# EAGLE design MotionerController (EAGLE 6.3)
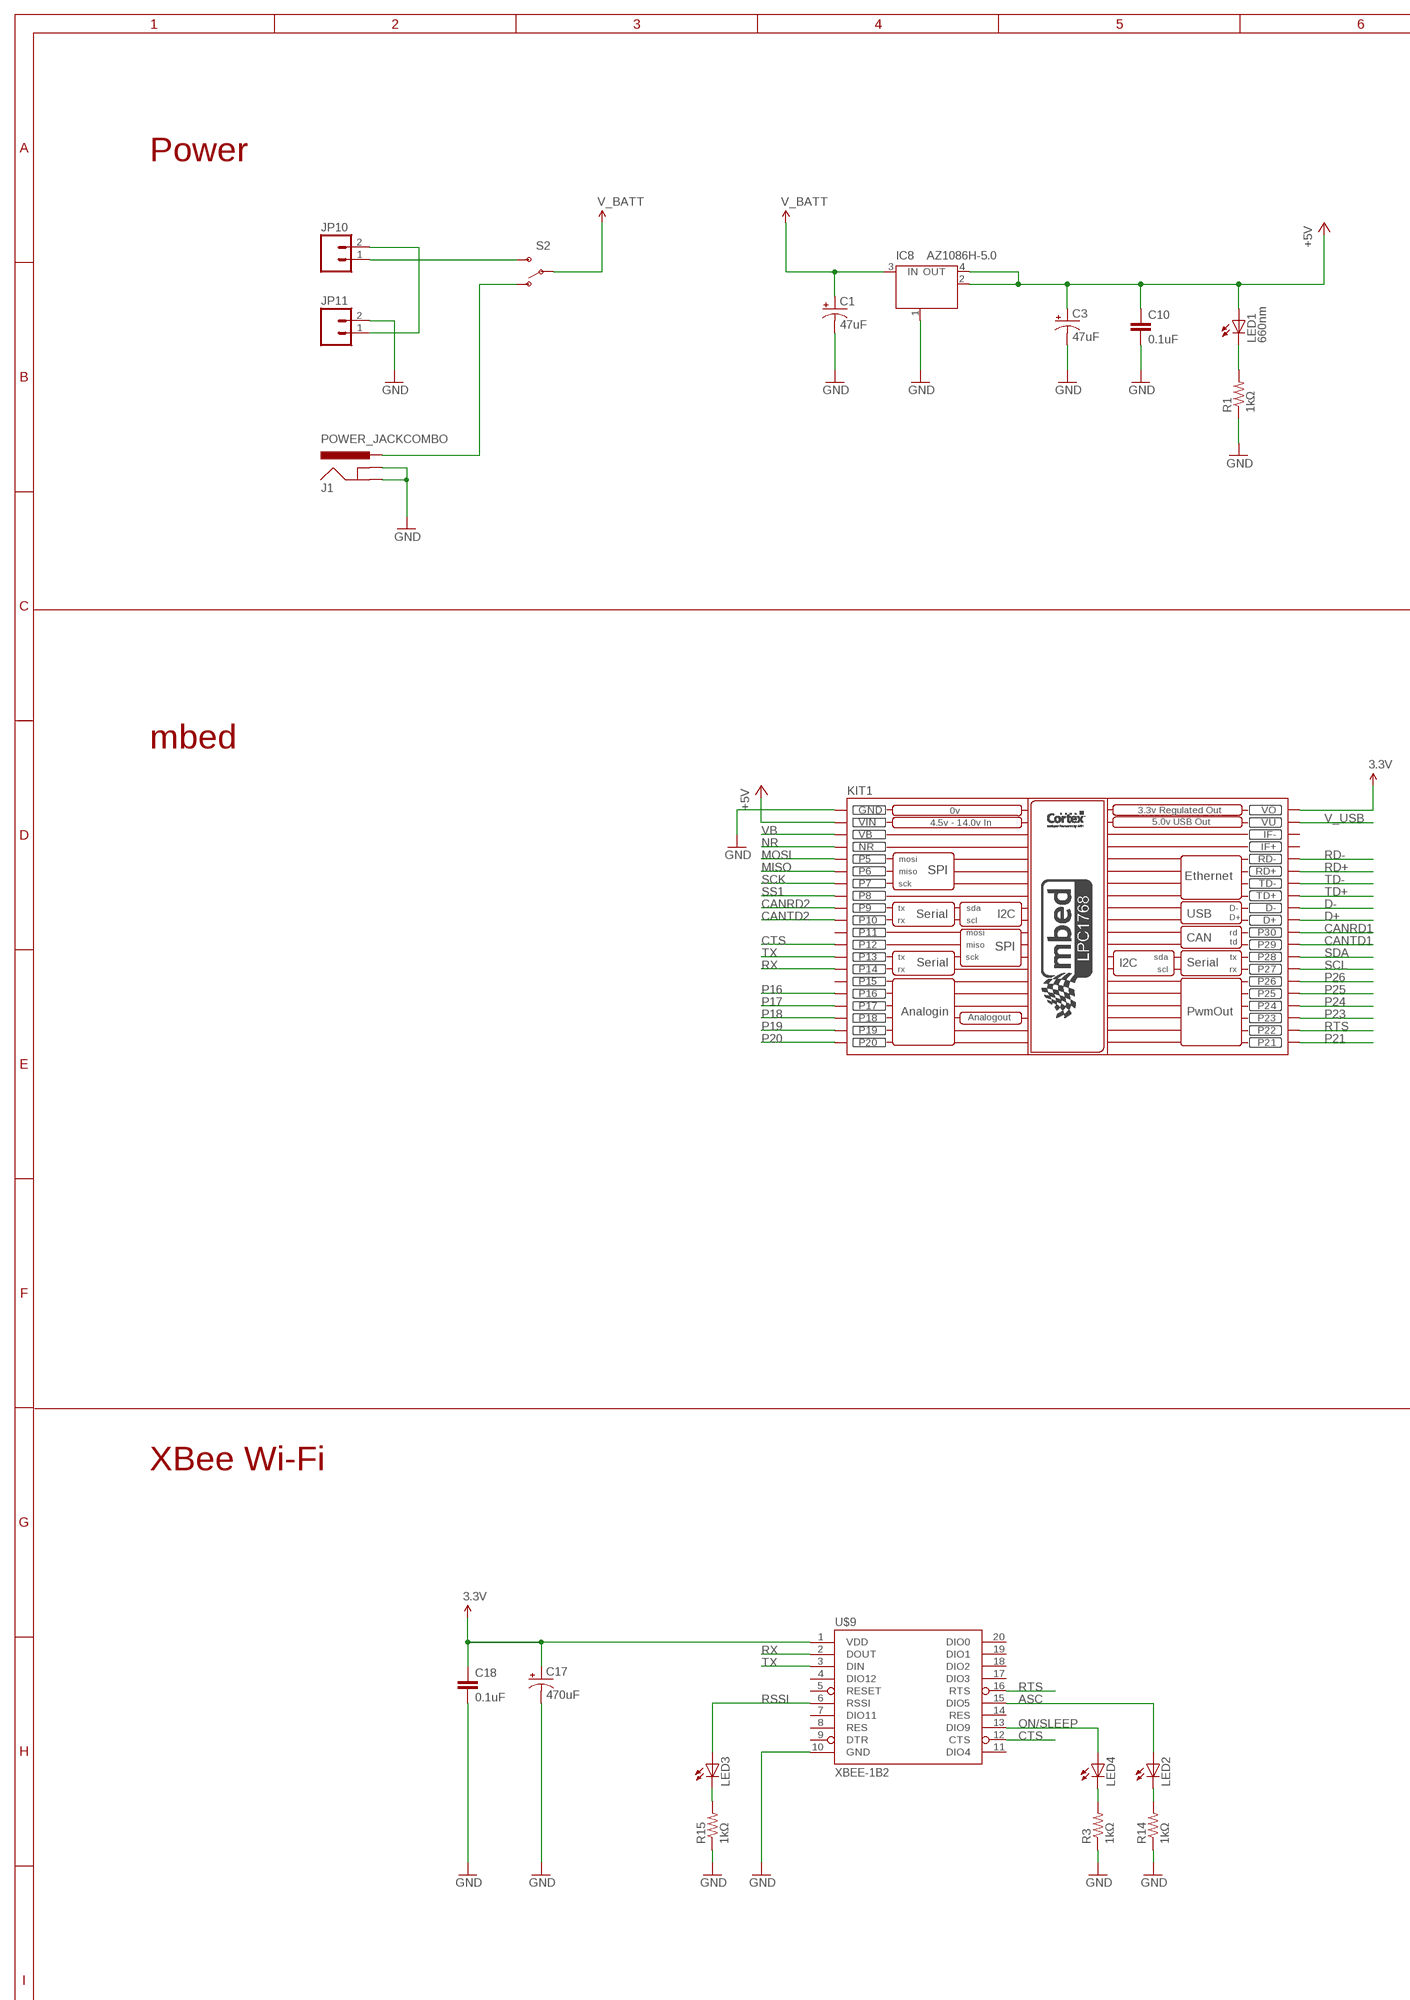
[diagram p0: schematic, sheet 1, part 1 of 2]
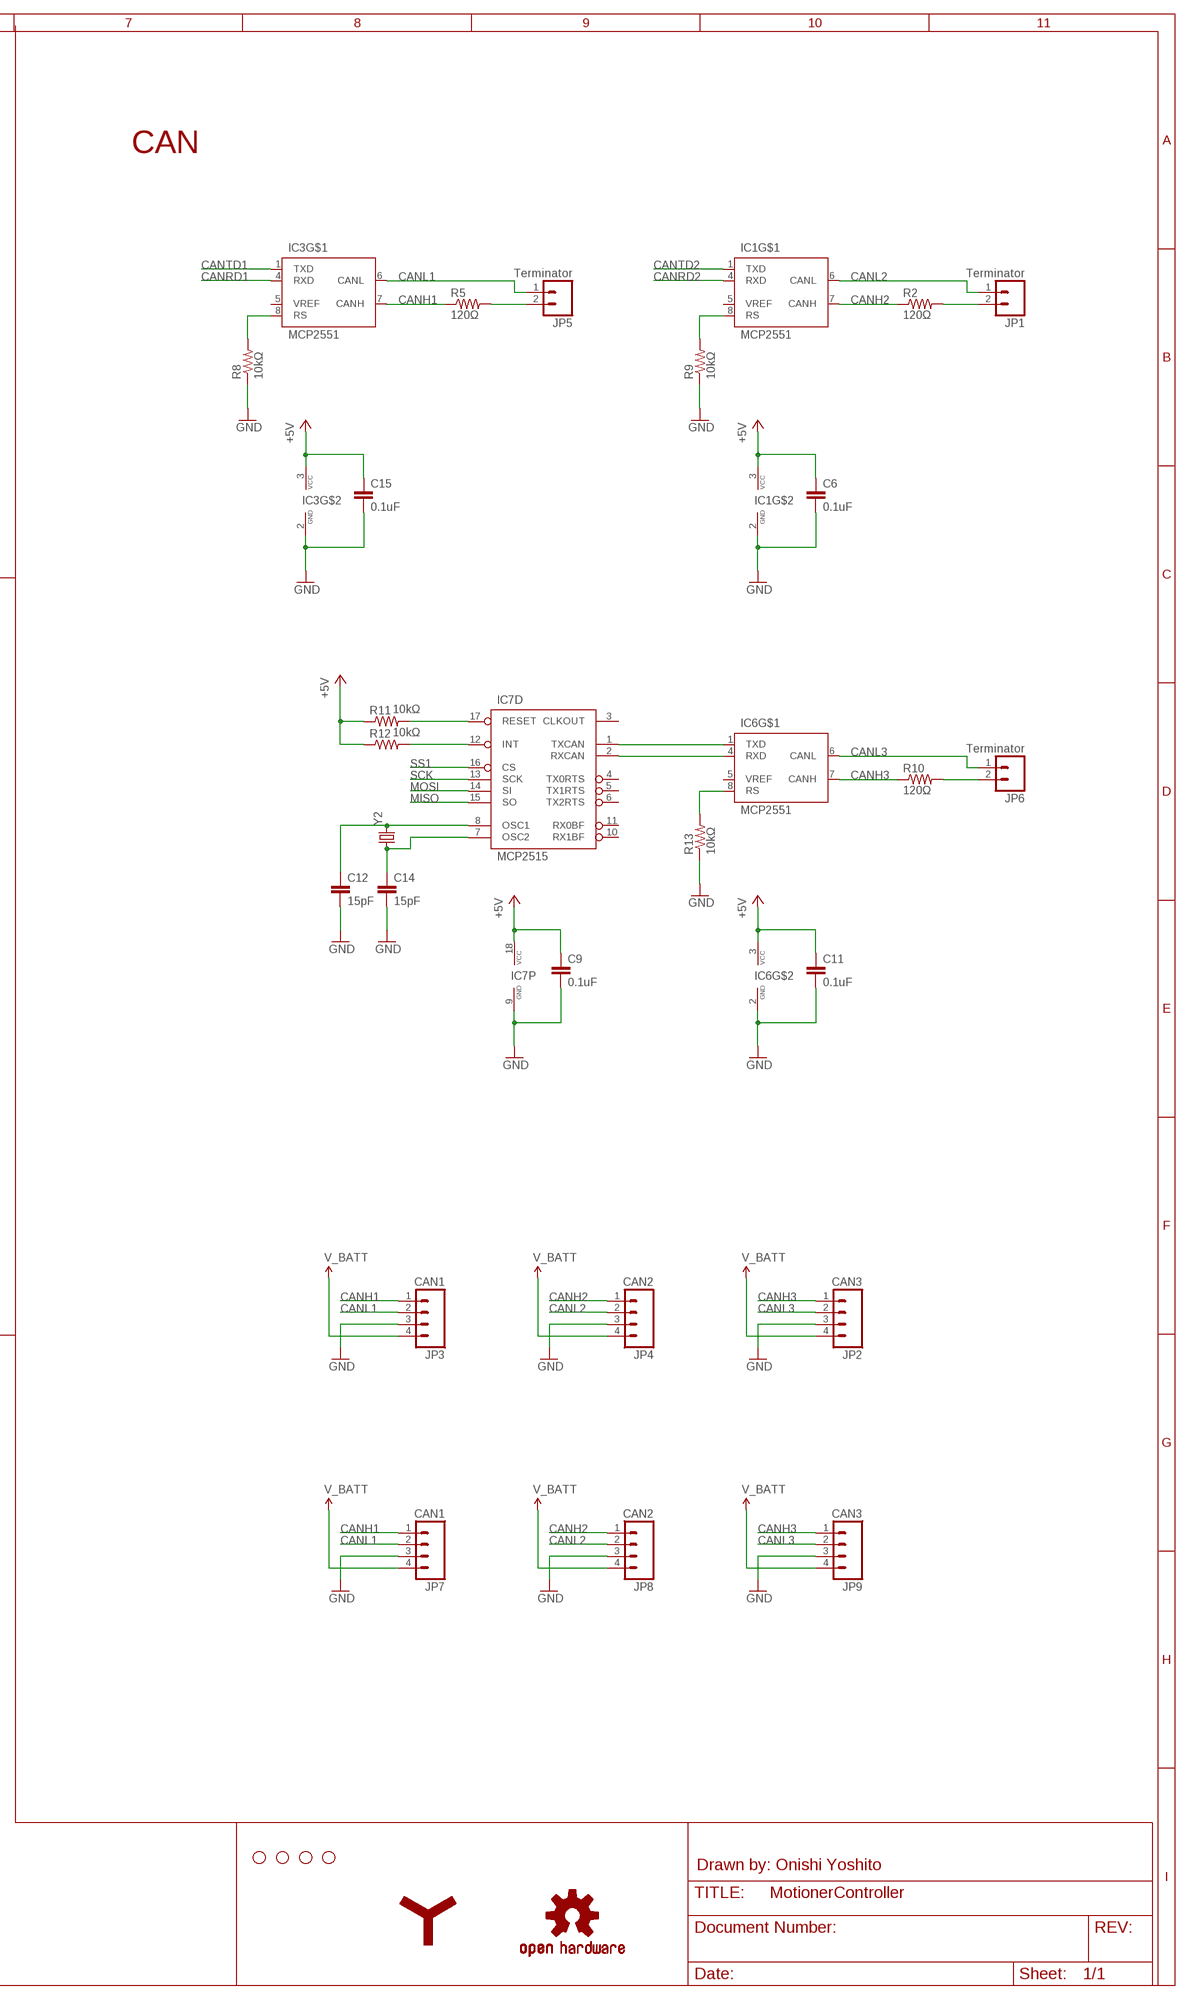
[diagram p1: schematic, sheet 1, part 2 of 2]

## Parts
C1  47uF  CAP_POLD  [PANASONIC_D]
C3  47uF  CAP_POLD  [PANASONIC_D]
C6  0.1uF  CAP0603-CAP  [0603-CAP]
C9  0.1uF  CAP0603-CAP  [0603-CAP]
C10  0.1uF  CAP0603-CAP  [0603-CAP]
C11  0.1uF  CAP0603-CAP  [0603-CAP]
C12  15pF  CAP0603-CAP  [0603-CAP]
C14  15pF  CAP0603-CAP  [0603-CAP]
C15  0.1uF  CAP0603-CAP  [0603-CAP]
C17  470uF  CAP_POLG  [PANASONIC_G]
C18  0.1uF  CAP0603-CAP  [0603-CAP]
IC1  MCP2551  MCP2551SO8  [SO08]
IC3  MCP2551  MCP2551SO8  [SO08]
IC6  MCP2551  MCP2551SO8  [SO08]
IC7  MCP2515  MCP2515SO  [SO-18W]
IC8  AZ1086H-5.0  MC33269ST-3.3T3  [SOT223]
J1  POWER_JACKCOMBO  [POWER_JACK_COMBO]
JP1  Terminator  M02PTH  [1X02]
JP2  CAN3  M04JST-PTH  [JST-4-PTH]
JP3  CAN1  M04JST-PTH  [JST-4-PTH]
JP4  CAN2  M04JST-PTH  [JST-4-PTH]
JP5  Terminator  M02PTH  [1X02]
JP6  Terminator  M02PTH  [1X02]
JP7  CAN1  M04JST-PTH  [JST-4-PTH]
JP8  CAN2  M04JST-PTH  [JST-4-PTH]
JP9  CAN3  M04JST-PTH  [JST-4-PTH]
JP10  M02JST-PTH-2  [JST-2-PTH]
JP11  M02JST-PTH-2  [JST-2-PTH]
JP12  STAND-OFF  [STAND-OFF]
JP13  STAND-OFF  [STAND-OFF]
JP15  STAND-OFF  [STAND-OFF]
JP16  STAND-OFF  [STAND-OFF]
KIT1  MBED_NXP_LPC1768  [MBED-KIT]
LED1  660nm  LED0603  [LED-0603]
LED2  LED0603  [LED-0603]
LED3  LED0603  [LED-0603]
LED4  LED0603  [LED-0603]
R1  1kΩ  RESISTOR0603-RES  [0603-RES]
R2  120Ω  RESISTOR0603-RES  [0603-RES]
R3  1kΩ  RESISTOR0603-RES  [0603-RES]
R5  120Ω  RESISTOR0603-RES  [0603-RES]
R8  10kΩ  RESISTOR0603-RES  [0603-RES]
R9  10kΩ  RESISTOR0603-RES  [0603-RES]
R10  120Ω  RESISTOR0603-RES  [0603-RES]
R11  10kΩ  RESISTOR0603-RES  [0603-RES]
R12  10kΩ  RESISTOR0603-RES  [0603-RES]
R13  10kΩ  RESISTOR0603-RES  [0603-RES]
R14  1kΩ  RESISTOR0603-RES  [0603-RES]
R15  1kΩ  RESISTOR0603-RES  [0603-RES]
S2  SWITCH-SPDTPTH  [SWITCH-SPDT]
U$9  XBEE-1B2  [XBEE-SILK]
U$10  YCAM_LOGO_L  [YCAM_LOGO_L]
U$12  OSHW-LOGOL  [OSHW-LOGO-L]
Y2  CRYSTAL5X3  [CRYSTAL-SMD-5X3]

## Nets
3.3V: C17.+ C18.1 KIT1.VOUT(VO) U$9.1(VDD)
7.4V [VBATT]: C1.+ IC8.3(IN) JP2.4 JP3.4 JP4.4 JP7.4 JP8.4 JP9.4 S2.2(P) ; supply symbol labelled V_BATT
+5V [+5V]: C3.+ C6.1 C9.1 C10.1 C11.1 C15.1 IC1.3(VCC) IC3.3(VCC) IC6.3(VCC) IC7.18(P:VCC) IC8.2(OUT) IC8.4(OUT) KIT1.VIN LED1.A R11.1 R12.1
ASC: LED2.A U$9.15(DIO5)
CANH1: IC3.7(CANH) JP3.1 JP7.1 R5.1
CANH2: IC1.7(CANH) JP4.1 JP8.1 R2.1
CANH3: IC6.7(CANH) JP2.1 JP9.1 R10.1
CANL1: IC3.6(CANL) JP3.2 JP5.1 JP7.2
CANL2: IC1.6(CANL) JP1.1 JP4.2 JP8.2
CANL3: IC6.6(CANL) JP2.2 JP6.1 JP9.2
CANRD1: IC3.4(RXD) KIT1.P$30(P30)
CANRD2: IC1.4(RXD) KIT1.P$9(P9)
CANTD1: IC3.1(TXD) KIT1.P$29(P29)
CANTD2: IC1.1(TXD) KIT1.P$10(P10)
CTS: KIT1.P$12(P12) U$9.12(CTS)
D+: KIT1.D+
D-: KIT1.D-
GND [GND]: C1.- C3.- C6.2 C9.2 C10.2 C11.2 C12.2 C14.2 C15.2 C17.- C18.2 IC1.2(GND) IC3.2(GND) IC6.2(GND) IC7.9(P:GND) IC8.1(GND/ADJ) J1.GND(GNDBREAK) J1.GND@1(GND) JP2.3 JP3.3 JP4.3 JP7.3 JP8.3 JP9.3 JP11.2 KIT1.GND R1.1 R3.1 R8.1 R9.1 R13.1 R14.1 R15.1 U$9.10(GND)
MISO: IC7.15(D:SO) KIT1.P$6(P6)
MOSI: IC7.14(D:SI) KIT1.P$5(P5)
N$1: LED1.C R1.2
N$2: J1.POWER(PWR) S2.1(O)
N$3: LED4.C R3.2
N$4: JP10.1 S2.3(S)
N$8: IC3.8(RS) R8.2
N$13: IC1.8(RS) R9.2
N$14: JP1.2 R2.2
N$17: IC6.1(TXD) IC7.1(D:TXCAN)
N$18: IC6.4(RXD) IC7.2(D:RXCAN)
N$19: IC7.12(D:INT) R12.2
N$20: JP5.2 R5.2
N$21: IC7.17(D:RESET) R11.2
N$22: IC6.8(RS) R13.2
N$23: JP6.2 R10.2
N$24: C12.1 IC7.8(D:OSC1) Y2.3
N$25: C14.1 IC7.7(D:OSC2) Y2.1
N$27: JP10.2 JP11.1
N$30: LED3.C R15.2
N$33: LED2.C R14.2
NR: KIT1.NR
ON/SLEEP: LED4.A U$9.13(DIO9)
P16: KIT1.P$16(P16)
P17: KIT1.P$17(P17)
P18: KIT1.P$18(P18)
P19: KIT1.P$19(P19)
P20: KIT1.P$20(P20)
P21: KIT1.P$21(P21)
P23: KIT1.P$23(P23)
P24: KIT1.P$24(P24)
P25: KIT1.P$25(P25)
P26: KIT1.P$26(P26)
RD+: KIT1.RD+
RD-: KIT1.RD-
RSSI: LED3.A U$9.6(RSSI)
RTS: KIT1.P$22(P22) U$9.16(RTS)
RX: KIT1.P$14(P14) U$9.2(DOUT)
SCK: IC7.13(D:SCK) KIT1.P$7(P7)
SCL: KIT1.P$27(P27)
SDA: KIT1.P$28(P28)
SS1: IC7.16(D:CS) KIT1.P$8(P8)
TD+: KIT1.TD+
TD-: KIT1.TD-
TX: KIT1.P$13(P13) U$9.3(DIN)
V_USB: KIT1.VU
VB: KIT1.VB
Unconnected: IC1.5(VREF) IC3.5(VREF) IC6.5(VREF) IC7.3(D:CLKOUT) IC7.4(D:TX0RTS) IC7.5(D:TX1RTS) IC7.6(D:TX2RTS) IC7.10(D:RX1BF) IC7.11(D:RX0BF) KIT1.IF+ KIT1.IF- KIT1.P$11(P11) KIT1.P$15(P15) U$9.4(DIO12) U$9.5(RESET) U$9.7(DIO11) U$9.8(RES) U$9.9(DTR) U$9.11(DIO4) U$9.14(RES) U$9.17(DIO3) U$9.18(DIO2) U$9.19(DIO1) U$9.20(DIO0)

## Notes on the sheet
- Power | CAN
- mbed
- XBee Wi-Fi
- Drawn by: Onishi Yoshito

## Library data of the parts
C1 C3 C17 = SparkFun-Passives:CAP_POL: Capacitor Polarized These are standard SMD and PTH capacitors. Normally 10uF, 47uF, and 100uF in electrolytic and tantalum varieties. Always verify the external diameter of the through hole cap, it varies with capacity, voltage, and manufacturer. The EIA devices should be standard.
C6 C9-C12 C14 C15 C18 = SparkFun-Passives:CAP: Capacitor Standard 0603 ceramic capacitor, and 0.1" leaded capacitor.
IC1 IC3 IC6 = can:MCP2551: CAN Tranceiver Microchip
IC7 = can:MCP2515: MC2515 Stand-Alone CAN Controller With SPI Interface, Microchip
IC8 = linear:MC33269ST*: Adjustable Output Low Dropout Voltage Regulator 800 mA Source: http://www.onsemi.com/pub/Collateral/MC33269-D.PDF
J1 = SparkFun-Connectors:POWER_JACK: Power Jack This is the standard 5.5mm barrel jack for power. The PTH is the most common, proven, reliable, footprint. All others are experimental. The Slot footprint only works if the mill layer is transmitted to the PCB fab house so be warned. Spark Fun Electronics SKU : PRT-00119. Mating wall wart : TOL-00298 (and others)
JP1 JP5 JP6 JP10 JP11 = SparkFun-Connectors:M02: Header 2 Standard 2-pin 0.1" header. Use with straight break away headers (SKU : PRT-00116), right angle break away headers (PRT-00553), swiss pins (PRT-00743), machine pins (PRT-00117), and female headers (PRT-00115). Molex polarized connector foot print use with SKU : PRT-08233 with associated crimp pins and housings.
JP2-JP4 JP7-JP9 = SparkFun-Connectors:M04: Header 4 Standard 4-pin 0.1" header. Use with straight break away headers (SKU : PRT-00116), right angle break away headers (PRT-00553), swiss pins (PRT-00743), machine pins (PRT-00117), and female headers (PRT-00115). Molex polarized connector foot print use with SKU : PRT-08231 with associated crimp pins and housings. 1MM SMD Version SKU: PRT-10208
JP12 JP13 JP15 JP16 = SparkFun-Electromechanical:STAND-OFF: #4 Stand Off This is the mechanical footprint for a #4 phillips button head screw. Use the keepout ring to avoid running the screw head into surrounding components. SKU : PRT-00447
KIT1 = MBED_v2.1:MBED_NXP_LPC1768: Mbed LPC1768 - ARM CORTEX v2.1 * Schematic symbol is now placed in eagles's default raster. *The pads diameter are suitable for routing between mbed pins * mbed pads are 0.8 mm drill diameter. --------------------------------------------- Created by: Mohamed Yousry *Alexandria, Egypt *Email: mohamed.yousry@ieeegoldegypt.org
LED1-LED4 = SparkFun-LED:LED: LEDs Standard schematic elements and footprints for 5mm, 3mm, 1206, and 0603 sized LEDs. 5mm - Spark Fun Electronics SKU : COM-00529 (and others)
R1-R3 R5 R8-R15 = SparkFun-Passives:RESISTOR: Resistor Basic schematic elements and footprints for 0603, 1206, and PTH resistors.
S2 = SparkFun-Electromechanical:SWITCH-SPDT: SPST Switch Simple slide switch. Spark Fun Electronics SKU : COM-00102
U$9 = SparkFun-RF:XBEE-1: Xbee module footprints
U$10 = ram:YCAM_LOGO_L
U$12 = SparkFun-Aesthetics:OSHW-LOGO: Open Source Hardware Logo This logo indicates the piece of hardware it is found on incorporates a OSHW license and/or adheres to the definition of open source hardware found here: http://freedomdefined.org/OSHW
Y2 = SparkFun-FreqCtrl:CRYSTAL: Various standard crystals. Proven footprints. Spark Fun Electronics SKU : COM-00534

## Net classes
0 Default: width 0.203 mm

## Board
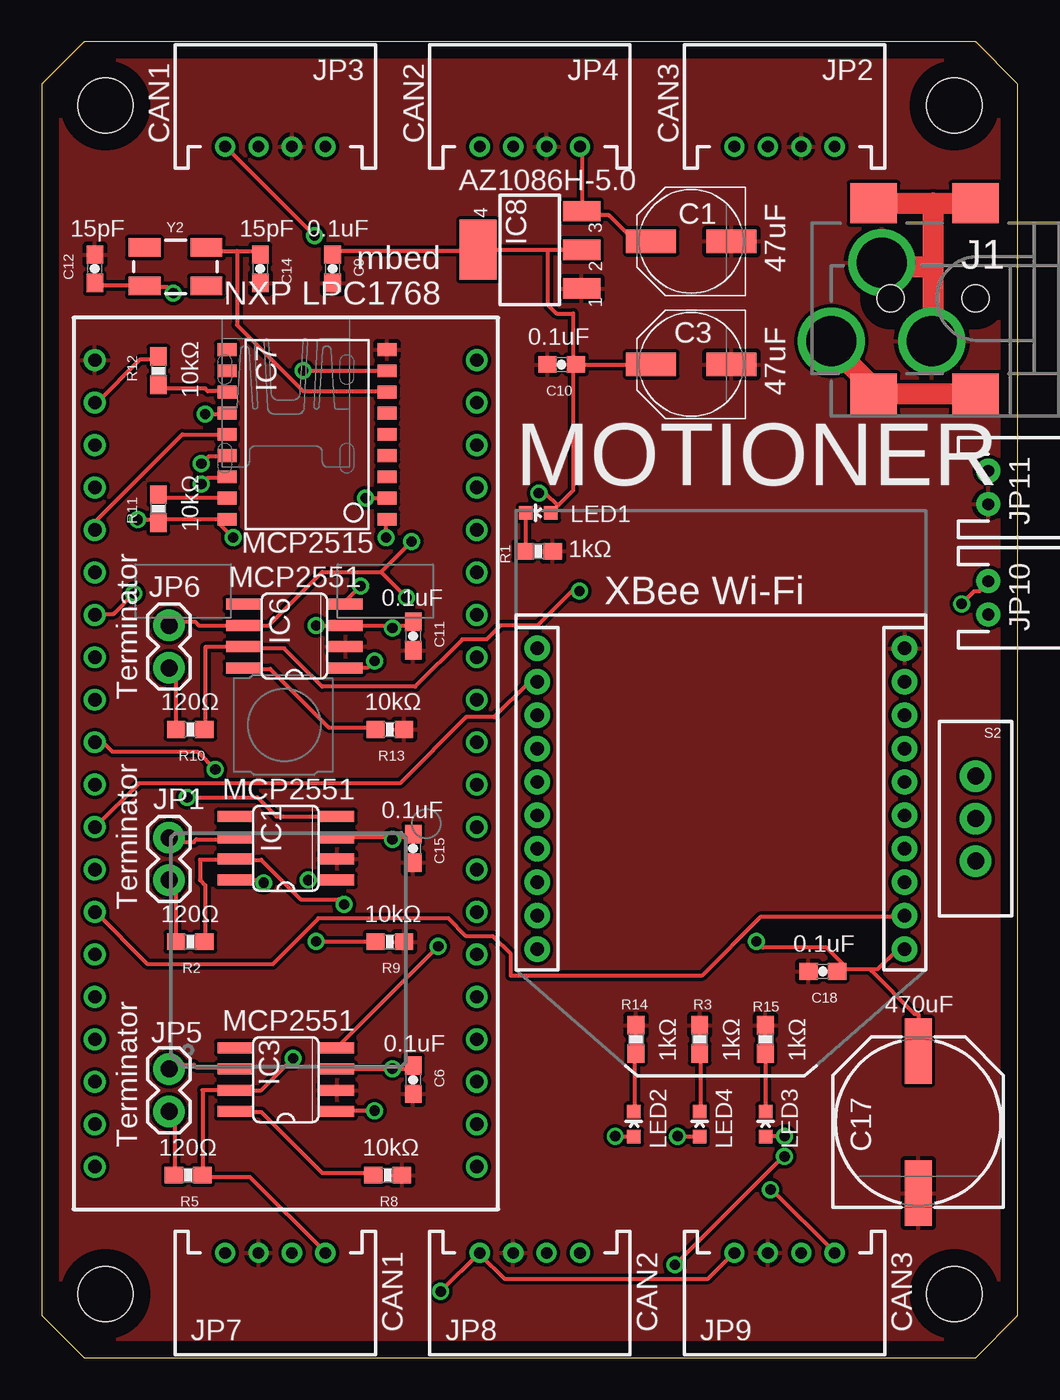
[diagram p2: board, top side]
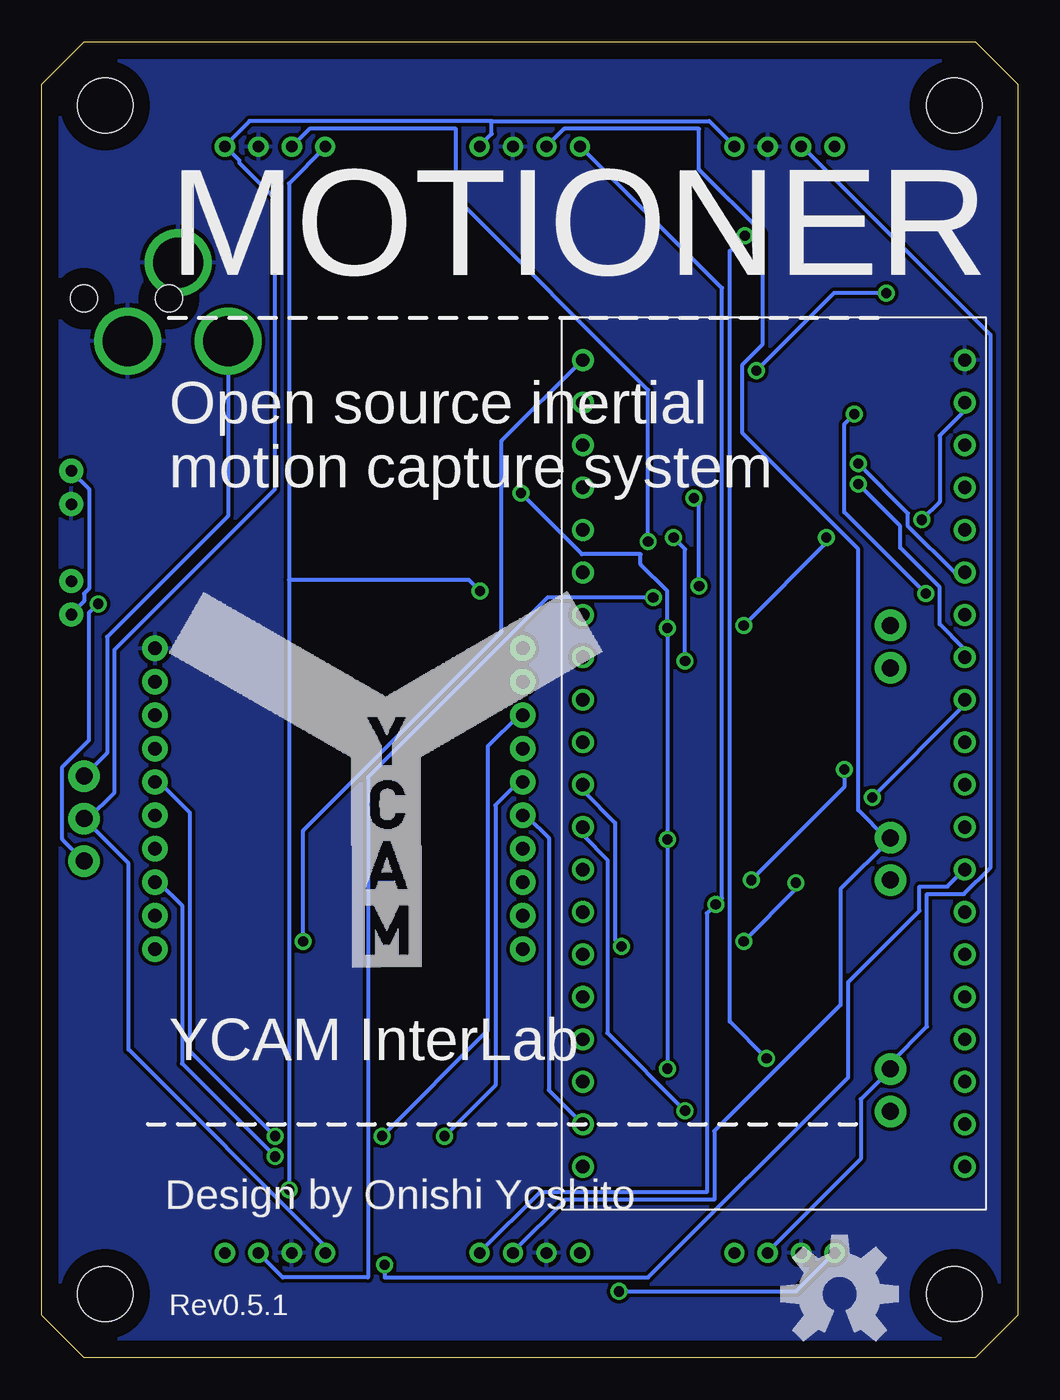
[diagram p3: board, bottom side, seen from below]

Size 58.41 x 78.74 mm. Coordinates in mm from the lower left corner, seen from the top.
Outline: 0,2.54 2.54,0 55.88,0 58.41,2.54 58.41,76.19 55.88,78.74 2.54,78.74 0,76.19 0,2.54
Copper layers (1*16): Top 0.035mm / dielectric 1.5mm / Bottom 0.035mm
Design rules "default": minimum track width 10mil, minimum drill 24mil, track to track 8mil, track to pad 8mil, pad to pad 8mil, via to via 8mil, smd to smd 8mil, copper to edge 40mil, drill to drill 8mil, minimum pad ring 10mil, minimum via ring 8mil, stop-mask expansion 4mil, vias tented up to drill 0mil, thermal gap 10mil

### Footprints (pad centres in the part's own frame; a part is rotated, then mirrored left to right if it is on the bottom)
PANASONIC_D = smd 3 x 1.4: + 2.4,0; - -2.4,0
0603-CAP = smd 1.1 x 1: 1 -0.85,0; 2 0.85,0
PANASONIC_G = smd 3.9 x 1.6: + 4.25,0; - -4.25,0
SO08 = smd 0.66 x 2.032: 1 -1.905,-3.073; 2 -0.635,-3.073; 3 0.635,-3.073; 4 1.905,-3.073; 5 1.905,3.073; 6 0.635,3.073; 7 -0.635,3.073; 8 -1.905,3.073
SO-18W = smd 0.762 x 1.143: 1 -5.08,-4.788; 2 -3.81,-4.788; 3 -2.54,-4.788; 4 -1.27,-4.788; 5 0,-4.788; 6 1.27,-4.788; 7 2.54,-4.788; 8 3.81,-4.788; 9 5.08,-4.788; 10 5.08,4.788; 11 3.81,4.788; 12 2.54,4.788; 13 1.27,4.788; 14 0,4.788; 15 -1.27,4.788; 16 -2.54,4.788; 17 -3.81,4.788; 18 -5.08,4.788
SOT223 = smd 1.219 x 2.235: 1 -2.311,-3.099; 2 0,-3.099; 3 2.311,-3.099 | smd 3.6 x 2.2: 4 0,3.099
POWER_JACK_COMBO = drill 2.997: GND 5.62,-2.16; GND@1 2.62,2.54; POWER 8.62,2.54 | smd 2.8 x 2.4: GND@3 0,-5.7; GND@4 6.1,-5.7; POWER@1 0,5.7; POWER@2 6.1,5.7 | hole 1.6: 0,0; 5.08,0
1X02 = drill 1.016 pad 1.88: 1 0,0; 2 2.54,0
JST-4-PTH = drill 0.7: 1 -3,-5; 2 -1,-5; 3 1,-5; 4 3,-5
JST-2-PTH = drill 0.7 pad 1.448: 1 -1,0; 2 1,0
STAND-OFF = hole 3.302: 0,0
MBED-KIT = drill 0.8: D+ 11.43,1.27; D- 11.43,3.81; GND -11.43,24.13; IF+ 11.43,16.51; IF- 11.43,19.05; NR -11.43,16.51; P$5 -11.43,13.97; P$6 -11.43,11.43; P$7 -11.43,8.89; P$8 -11.43,6.35; P$9 -11.43,3.81; P$10 -11.43,1.27; P$11 -11.43,-1.27; P$12 -11.43,-3.81; P$13 -11.43,-6.35; P$14 -11.43,-8.89; P$15 -11.43,-11.43; P$16 -11.43,-13.97; P$17 -11.43,-16.51; P$18 -11.43,-19.05; P$19 -11.43,-21.59; P$20 -11.43,-24.13; P$21 11.43,-24.13; P$22 11.43,-21.59; P$23 11.43,-19.05; P$24 11.43,-16.51; P$25 11.43,-13.97; P$26 11.43,-11.43; P$27 11.43,-8.89; P$28 11.43,-6.35; P$29 11.43,-3.81; P$30 11.43,-1.27; RD+ 11.43,11.43; RD- 11.43,13.97; TD+ 11.43,6.35; TD- 11.43,8.89; VB -11.43,19.05; VIN -11.43,21.59; VOUT 11.43,24.13; VU 11.43,21.59
LED-0603 = smd 0.8 x 0.8: A 0,-0.75; C 0,0.75
0603-RES = smd 1.1 x 1: 1 -0.85,0; 2 0.85,0
SWITCH-SPDT = drill 1.016 pad 1.88: 1 0,2.54; 2 0,0; 3 0,-2.54
XBEE-SILK = drill 0.8 pad 1.524: 1 -11,20; 2 -11,18; 3 -11,16; 4 -11,14; 5 -11,12; 6 -11,10; 7 -11,8; 8 -11,6; 9 -11,4; 10 -11,2; 11 11,2; 12 11,4; 13 11,6; 14 11,8; 15 11,10; 16 11,12; 17 11,14; 18 11,16; 19 11,18; 20 11,20
CRYSTAL-SMD-5X3 = smd 1.9 x 1.1: 1 -1.85,-1.15; 2 1.85,-1.15; 3 1.85,1.15; 4 -1.85,1.15

### Placement (x,y rotation side)
C1  38.86,66.8 180 top
C3  38.86,59.44 180 top
C6  22.22,16.64 270 top
C9  17.4,65.15 270 top
C10  31.11,59.44 180 top
C11  22.22,43.18 270 top
C12  3.17,65.15 90 top
C14  13.08,65.15 270 top
C15  22.22,30.48 270 top
C17  52.45,14.1 90 top
C18  46.74,23.11 180 top
IC1  14.61,30.48 90 top
IC3  14.61,16.64 90 top
IC6  15.11,43.18 90 top
IC7  15.87,55.24 90 top
IC8  29.21,66.29 90 top
J1  55.88,63.37 180 top
JP1  7.62,31.11 270 top
JP2  44.45,77.47 0 top
JP3  13.97,77.47 0 top
JP4  29.21,77.47 0 top
JP5  7.62,17.27 270 top
JP6  7.62,43.81 270 top
JP7  13.97,1.27 180 top
JP8  29.21,1.27 180 top
JP9  44.45,1.27 180 top
JP10  56.64,45.47 270 top
JP11  56.64,52.07 270 top
JP12  54.61,74.93 0 top
JP13  54.61,3.81 0 top
JP15  3.81,74.93 90 top
JP16  3.81,3.81 90 top
KIT1  14.61,35.56 0 top
LED1  29.72,50.55 90 top
LED2  35.43,13.97 0 top
LED3  43.31,13.97 0 top
LED4  39.37,13.97 0 top
R1  29.72,48.26 180 top
R2  8.89,24.89 180 top
R3  39.37,19.05 270 top
R5  8.76,10.92 180 top
R8  20.7,10.92 180 top
R9  20.83,24.89 180 top
R10  8.89,37.59 180 top
R11  6.98,50.8 90 top
R12  6.98,59.05 270 top
R13  20.83,37.59 180 top
R14  35.56,19.05 270 top
R15  43.31,19.05 270 top
S2  55.88,32.26 0 top
U$9  40.64,44.45 180 top
U$10  50.8,21.59 0 bottom
U$12  10.67,3.81 0 bottom
Y2  8,65.28 180 top

### Tracks (layer width: path | path; a pad name or v marks a point on that pad's centre or on a via)
3.3V  (via drill 0.61)
  Top 0.254: 49.63,23.24 50.01,23.24 51.16,24.38 51.61,24.38 U$9.1 | 49.63,23.24 47.73,23.24 47.65,23.16 C18.1 47.95,23.32 47.95,23.55 46.97,24.54 43.16,24.54 v42.77,24.92 | C17.+ 52.45,20.57 52.22,20.57 49.63,23.16 49.63,23.24
  Bottom 0.254: v42.77,24.92 42.77,31.55 30.89,43.43 30.89,54.86 26.09,59.66 KIT1.VOUT
7.4V  (via drill 0.61)
  Top 0.254: C1.+ 36.45,66.83 35.46,66.83 33.93,68.35 32.56,68.35 IC8.3 32.33,68.66 32.33,72.47 32.26,72.47 JP4.4 | v23.88,3.96 26.16,6.25 JP8.4 26.24,6.17 27.69,4.72 39.88,4.72 41.4,6.25 JP9.4
  Bottom 0.254: 31.5,73.99 18.47,73.99 17.02,72.54 JP3.4 | 31.5,73.99 31.5,73.23 32.18,72.54 JP4.4 | 31.5,73.99 45.97,73.99 47.42,72.54 JP2.4 47.35,72.39 46.58,71.63 46.58,71.48 44.45,69.34 44.45,51.97 54.05,42.37 54.05,33.83 55.65,32.23 55.65,32.16 S2.2 55.88,32.23 53.21,29.57 53.21,18.44 41.48,6.71 41.48,6.33 JP9.4 | v23.88,3.96 13.28,3.96 11,6.25 JP7.4
+5V  (via drill 0.61)
  Top 0.254: 30.89,50.98 31.8,51.89 31.8,59.44 C10.1 | 30.89,50.98 30.5,50.6 LED1.A | C10.1 C3.+ | C9.1 17.4,66.06 17.55,66.22 26.01,66.22 26.09,66.29 IC8.4 30.28,66.29 | 30.28,66.29 IC8.2 | 30.28,66.29 30.28,63.02 30.81,62.48 31.8,62.48 31.8,59.51 C10.1 | C6.1 22.2,17.45 22.05,17.3 v20.98,17.3 17.7,17.3 IC3.3 | 20.98,31.17 17.7,31.17 IC1.3 | 20.98,31.17 22.05,31.17 22.2,31.32 C15.1 | v20.98,31.01 20.98,31.17 | 20.98,43.81 IC6.3 v16.41,43.81 | 20.98,43.81 22.05,43.81 22.2,43.97 C11.1 | KIT1.VIN 3.3,57.15 5.89,59.74 6.81,59.74 6.96,59.89 R12.1 | v5.74,50.14 6.73,50.14 6.88,49.99 R11.1 7.04,49.99 7.19,50.14 11.07,50.14 IC7.18 10.69,50.06 10.69,49.84 v11.46,49.07 | v20.98,43.66 20.98,43.81 | 30.89,50.98 30.12,51.74 v29.74,51.74
  Bottom 0.254: v20.98,17.3 v20.98,31.01 v20.98,43.66 20.98,45.87 22.58,47.47 22.58,48.08 26.09,48.08 v29.74,51.74 | v5.74,50.14 4.67,51.21 4.67,55.17 3.23,56.62 3.23,57.15 KIT1.VIN | v16.41,43.81 11.46,48.77 v11.46,49.07
ASC  (via drill 0.61)
  Top 0.254: v34.31,13.26 35.38,13.26 LED2.A
  Bottom 0.254: v34.31,13.26 31.27,16.31 31.27,33.07 29.9,34.44 29.67,34.44 U$9.15
CANH1  (via drill 0.61)
  Top 0.254: JP7.1 16.94,6.33 12.45,10.82 9.63,10.82 R5.1 9.63,10.97 9.63,16 IC3.7 13.13,16 v15.04,17.91 | v16.33,67.13 11,72.47 JP3.1
  Bottom 0.254: v16.33,67.13 17.25,66.22 17.25,20.12 v15.04,17.91
CANH2  (via drill 0.61)
  Top 0.254: R2.1 9.78,24.92 9.78,28.27 9.47,28.57 9.47,29.79 11.53,29.79 IC1.7 11.61,29.79 13.13,29.79 15.49,27.43 17.78,27.43 v18.08,27.13
  Bottom 0.254: JP8.1 32.18,6.33 28.6,9.91 18.62,9.91 18.62,26.59 v18.08,27.13 17.7,27.51 17.7,64.01 26.16,72.47 JP4.1
CANH3  (via drill 0.61)
  Top 0.254: R10.1 9.78,37.64 9.78,42.52 11.99,42.52 IC6.7 12.14,42.52 12.22,42.44 14.5,42.44 16.79,40.16 22.35,40.16 25.17,42.98 26.62,42.98 27.46,43.81 29.67,43.81 31.72,45.87 v32.18,45.87 | v43.61,10.06 43.69,10.06 47.42,6.33 JP9.1
  Bottom 0.254: 43.61,46.56 43.61,70.26 41.48,72.39 41.48,72.47 JP2.1 | 43.61,46.56 v43.61,10.06 | v32.18,45.87 32.87,46.56 43.61,46.56
CANL1
  Top 0.254: IC3.6 11.53,17.3 11.46,17.37 9.25,17.37 9.09,17.53 8.48,17.53 8.25,17.3 7.64,17.3 JP5.1
  Bottom 0.254: JP7.2 14.96,6.33 9.4,11.89 9.4,15.47 7.64,17.22 JP5.1 7.57,17.37 7.57,17.68 5.44,19.81 5.44,27.74 3.23,27.74 1.63,29.34 1.63,61.19 12.9,72.47 JP3.2
CANL2
  Top 0.254: IC1.6 11.53,31.09 11.46,31.01 9.25,31.01 9.09,30.86 8.48,30.86 8.25,31.09 7.64,31.09 JP1.1
  Bottom 0.254: JP8.2 30.2,6.33 27.08,9.45 18.16,9.45 18.16,13.56 10.62,21.11 10.62,28.04 7.64,31.01 7.64,31.09 JP1.1 7.8,31.01 9.55,32.77 9.55,48.39 16.48,55.32 16.48,59.44 15.26,60.66 15.26,67.28 19.07,71.09 19.07,73.53 27.15,73.53 28.14,72.54 JP4.2
CANL3  (via drill 0.61)
  Top 0.254: JP6.1 8.25,43.81 8.48,44.04 9.17,44.04 9.4,43.81 IC6.6 13.59,43.81 16.79,47.02 20.29,47.02 | 20.29,47.02 v21.82,45.49 | 20.29,47.02 v22.12,48.84
  Bottom 0.254: v21.82,45.49 28.14,45.49 38.89,34.75 38.89,4.8 43.99,4.8 45.44,6.25 JP9.2 | v22.12,48.84 22.12,57.91 33.63,69.42 33.63,73.53 42.39,73.53 43.38,72.54 JP2.2
CANRD1  (via drill 0.61)
  Top 0.254: v23.72,24.61 17.7,18.59 IC3.4
  Bottom 0.254: v23.72,24.61 24.11,24.99 24.11,32 26.01,33.91 26.01,34.29 KIT1.P$30
CANRD2  (via drill 0.61)
  Top 0.254: IC1.4 14.05,32.38 12.9,33.53 v8.71,33.53
  Bottom 0.254: v8.71,33.53 3.23,39.01 3.23,39.32 KIT1.P$9
CANTD1  (via drill 0.61)
  Top 0.254: v19.91,14.78 17.7,14.78 IC3.1
  Bottom 0.254: v19.91,14.78 24.56,19.43 24.56,29.79 26.01,31.24 26.01,31.7 KIT1.P$29
CANTD2  (via drill 0.61)
  Top 0.254: v15.95,28.57 IC1.1 | v10.39,35.2 9.32,36.27 4.22,36.27 3.68,36.8 3.23,36.8 KIT1.P$10
  Bottom 0.254: v15.95,28.57 10.39,34.14 v10.39,35.2
CTS
  Top 0.254: KIT1.P$12 3.23,31.77 5.82,34.37 21.44,34.37 25.4,38.33 27.08,38.33 29.13,40.39 29.59,40.39 U$9.12
GND
  pour Top: 2.54,78.74 55.88,78.74 58.42,76.2 58.42,2.54 55.88,0 2.54,0 0,2.54 0,76.2
  pour Bottom: 2.54,78.74 55.88,78.74 58.42,76.2 58.42,2.54 55.88,0 2.54,0 0,2.54 0,76.2
MISO  (via drill 0.61)
  Top 0.254: v9.55,53.49 10.01,53.95 11.07,53.95 IC7.15
  Bottom 0.254: v9.55,53.49 6.58,50.52 6.58,49.76 3.76,46.94 3.23,46.94 KIT1.P$6
MOSI
  Top 0.254: IC7.14 8.41,55.24 3.23,50.06 3.23,49.53 KIT1.P$5
N$1
  Top 0.254: LED1.C 28.98,50.52 28.98,48.31 28.9,48.31 R1.2
N$2
  Bottom 0.254: S2.1 55.88,34.82 54.51,36.2 54.51,43.13 47.27,50.37 47.27,60.81 J1.POWER
N$3
  Top 0.254: LED4.C 39.42,14.78 39.42,18.14 R3.2
N$4  (via drill 0.61)
  Top 0.254: v55.04,45.11 55.8,45.87 56.11,45.87 56.64,46.41 JP10.1
  Bottom 0.254: v55.04,45.11 55.58,44.58 55.58,36.96 57.17,35.36 57.17,31.01 S2.3
N$8
  Top 0.254: R8.2 19.84,10.97 19.76,11.05 16.79,11.05 13.13,14.71 11.53,14.71 IC3.8
N$13  (via drill 0.61)
  Top 0.254: v16.41,24.92 19.91,24.92 R9.2 | v13.28,28.42 13.13,28.57 IC1.8
  Bottom 0.254: v16.41,24.92 13.28,28.04 v13.28,28.42
N$14
  Top 0.254: JP1.2 8.03,28.57 8.03,24.92 R2.2
N$17  (via drill 0.61)
  Top 0.254: v20.6,49.07 20.6,50.14 IC7.1 | v19.91,41.68 19.53,41.3 18.24,41.3 IC6.1
  Bottom 0.254: v20.6,49.07 19.91,48.39 v19.91,41.68
N$18  (via drill 0.61)
  Top 0.254: v19.38,51.44 IC7.2 | v19.07,46.18 18.24,45.34 18.24,45.11 IC6.4
  Bottom 0.254: v19.38,51.44 19.07,51.13 v19.07,46.18
N$19
  Top 0.254: R12.2 7.04,58.14 7.19,57.99 9.78,57.99 9.93,57.84 11.07,57.84 IC7.12
N$20
  Top 0.254: R5.2 7.95,10.97 7.95,14.71 7.64,14.71 JP5.2
N$21
  Top 0.254: IC7.17 7.19,51.44 7.04,51.59 R11.2
N$22
  Top 0.254: R13.2 19.91,37.64 19.84,37.72 17.17,37.72 13.66,41.22 12.07,41.22 IC6.8
N$23
  Top 0.254: R10.2 8.03,37.64 8.03,41.22 7.64,41.22 JP6.2
N$24  (via drill 0.61)
  Top 0.254: C12.1 3.23,64.24 3.3,64.16 6.12,64.16 Y2.3 6.27,64.08 7.49,64.08 v7.87,63.7 | v15.65,59.05 IC7.8
  Bottom 0.254: v15.65,59.05 11,63.7 v7.87,63.7
N$25
  Top 0.254: 11.68,66.22 10.01,66.22 9.86,66.37 Y2.1 | 11.68,66.22 12.9,66.22 13.06,66.06 C14.1 | 11.68,66.22 11.68,61.8 15.65,57.84 20.6,57.84 IC7.7
N$27
  Bottom 0.254: JP10.2 56.64,44.5 55.88,45.26 55.88,45.72 55.58,46.02 55.58,51.97 56.64,53.03 JP11.1
N$30
  Top 0.254: R15.2 LED3.C
N$33
  Top 0.254: LED2.C 35.46,14.78 35.46,18.14 35.53,18.14 R14.2
ON/SLEEP  (via drill 0.61)
  Top 0.254: v38.05,13.26 39.34,13.26 LED4.A
  Bottom 0.254: v38.05,13.26 31.72,19.58 31.72,36.58 29.9,38.41 29.67,38.41 U$9.13
RSSI  (via drill 0.61)
  Top 0.254: v44.45,13.26 43.31,13.26 LED3.A
  Bottom 0.254: v44.45,13.26 49.56,18.36 49.56,32.61 51.38,34.44 51.61,34.44 U$9.6
RTS
  Bottom 0.254: KIT1.P$22 28.07,16 28.07,31.09 29.36,32.38 29.59,32.38 U$9.16
RX
  Top 0.254: KIT1.P$14 3.23,26.67 6.35,23.55 13.82,23.55 16.56,26.29 24.33,26.29 25.4,25.22 27,25.22 28.07,24.16 28.07,22.86 39.5,22.86 43,26.36 51.54,26.36 51.61,26.44 U$9.2
SCK  (via drill 0.61)
  Top 0.254: v9.78,56.46 11.07,56.46 IC7.13 | v5.51,45.72 4.29,44.5 3.23,44.5 KIT1.P$7
  Bottom 0.254: v9.78,56.46 10.39,55.85 10.39,50.6 v5.51,45.72
SS1  (via drill 0.61)
  Top 0.254: v9.55,52.27 9.93,52.65 11.07,52.65 IC7.16
  Bottom 0.254: v9.55,52.27 7.04,49.76 7.04,48.46 4.67,46.1 4.67,43.89 3.23,42.44 3.23,41.91 KIT1.P$8
TX  (via drill 0.61)
  Top 0.254: v37.9,5.56 44.37,12.04 v44.45,12.04
  Bottom 0.254: v37.9,5.56 37.9,4.8 22.12,4.8 10.16,16.76 10.16,22.48 5.89,26.75 5.89,28.19 4.22,28.19 3.23,29.18 KIT1.P$13 | v44.45,12.04 50.01,17.6 50.01,27.05 51.38,28.42 51.61,28.42 U$9.3

### Text on the board
tPlace: mbed / NXP LPC1768 | MOTIONER | XBee Wi-Fi
bPlace: MOTIONER | Open source inertial / motion capture system | YCAM InterLab | Design by Onishi Yoshito | Rev0.5.1